# Altium schematic sheet [17] Changelog.SchDoc: Hardware changelog
size A4; Engineer: M. Folejewski; DocumentNumber: 15; SheetNumber: 15; SheetTotal: 15; PageSize: A4; Designators: -
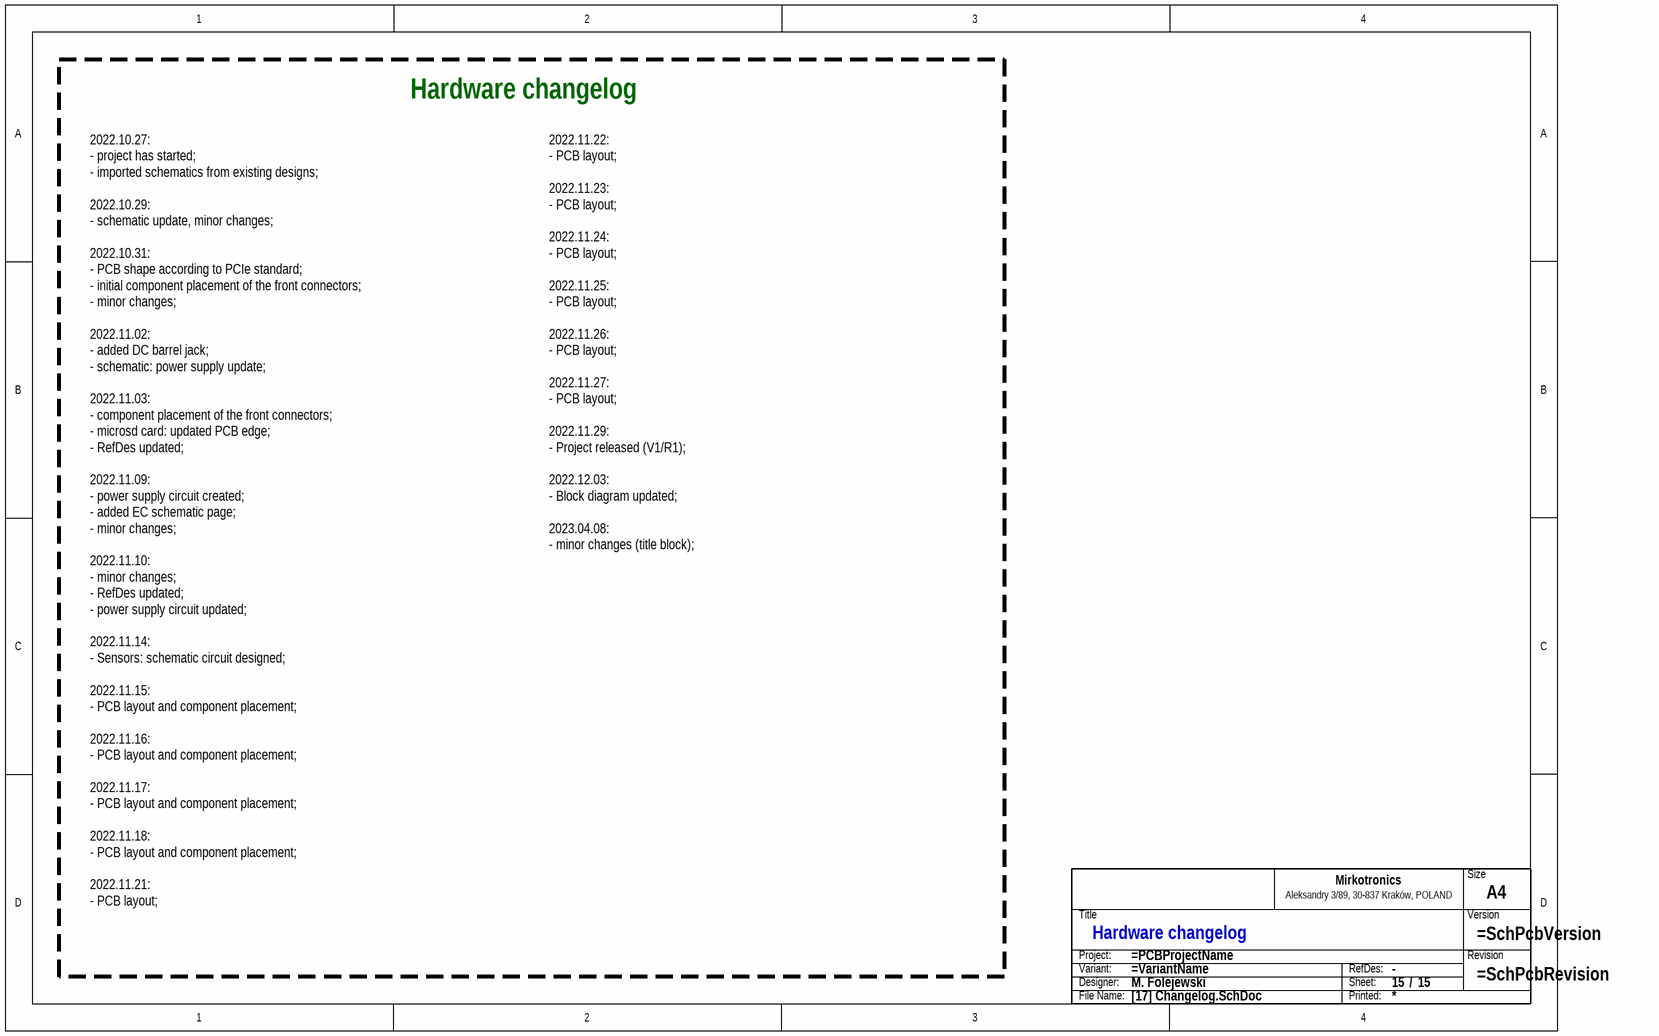
[diagram p0: [17] Changelog.SchDoc]

## Parts
TB?  Title block  (value not drawn)  (graphical)

## Notes on the sheet
- Hardware changelog
- 2022.10.27:
  - project has started;
  - imported schematics from existing designs;
  2022.10.29:
  - schematic update, minor changes;
  2022.10.31:
  - PCB shape according to PCIe standard;
  - initial component placement of the front connectors;
  - minor changes;
  2022.11.02:
  - added DC barrel jack;
  - schematic: power supply update;
  2022.11.03:
  - component placement of the front connectors;
  - microsd card: updated PCB edge;
  - RefDes updated;
  2022.11.09:
  - power supply circuit created;
  - added EC schematic page;
  - minor changes;
  2022.11.10:
  - minor changes;
  - RefDes updated;
  - power supply circuit updated;
  2022.11.14:
  - Sensors: schematic circuit designed;
  2022.11.15:
  - PCB layout and component placement;
  2022.11.16:
  - PCB layout and component placement;
  2022.11.17:
  - PCB layout and component placement;
  2022.11.18:
  - PCB layout and component placement;
  2022.11.21:
  - PCB layout;
- 2022.11.22:
  - PCB layout;
  2022.11.23:
  - PCB layout;
  2022.11.24:
  - PCB layout;
  2022.11.25:
  - PCB layout;
  2022.11.26:
  - PCB layout;
  2022.11.27:
  - PCB layout;
  2022.11.29:
  - Project released (V1/R1);
  2022.12.03:
  - Block diagram updated;
  2023.04.08:
  - minor changes (title block);
- (in symbol SCH_TITLE_BLOCK_MIRKOTRONICS_V2) Size; Mirkotronics; Aleksandry 3/89, 30-837 Kraków, POLAND; Title; Version; Project:; Revision; Variant:; RefDes:; Designer:; Sheet:; /; File Name:; Printed:

## Library data of the parts
TB? = SCH_TITLE_BLOCK_MIRKOTRONICS_V2: Component Type: Title block; Manufacturer: -; Mounting Type: Non component; MPN: -; Operating Temperature: -; Package: -; Specification: Title block; Value: Title block; Replacement: -; System: ?